# Altium project Chov3.PrjPCB
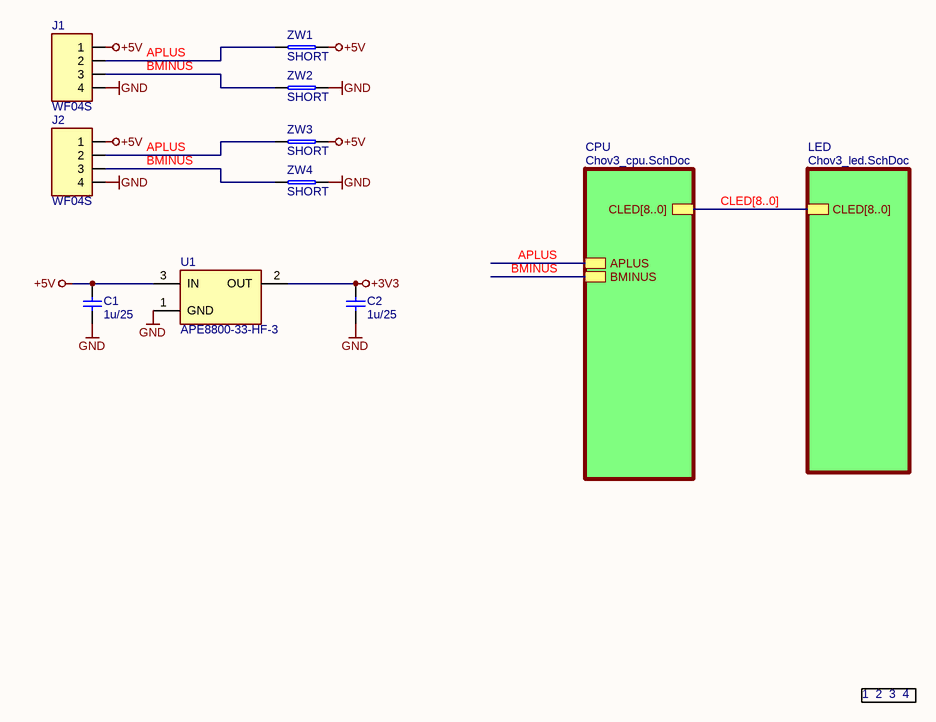
[diagram p0: Chov3_main.SchDoc]
Nazwa_Projektu: Lampka LED na choinkê; Wersja: 2
3 sheets, 55 parts. Net scope: hierarchical (ports join the sheet entries above them; power ports are global).
Board files: Chov3.PcbDoc, Chov3F.PcbDoc
Sheets:
  Chov3_main.SchDoc
    CPU = Chov3_cpu.SchDoc
    LED = Chov3_led.SchDoc

## Sheet Chov3_main.SchDoc
size A4; DocumentNumber: 1; SheetNumber: 1; SheetTotal: 3; LotOfPieces: 1

### Parts
C1  OtherParams: 1u/25  [0805]  (hidden comment: CL21B105KAFNNNG)
C2  OtherParams: 1u/25  [0805]  (hidden comment: CL21B105KAFNNNG)
J1  WF04S  [WF04S]
J2  WF04S  [WF04S]
NUMBERS1  WARSTWYT_M1_M2_B  [WARSTWYT_M1_M2_B]  (value not drawn)  (no BOM)
U1  APE8800-33-HF-3  [SOT23-3]
ZW1  SHORT  [SHORT0805]
ZW2  SHORT  [SHORT0805]
ZW3  SHORT  [SHORT0805]
ZW4  SHORT  [SHORT0805]

### Sub-sheets
CPU = Chov3_cpu.SchDoc: CLED[8..0], APLUS, BMINUS
LED = Chov3_led.SchDoc: CLED[8..0]

### Nets
+3V3: C2.1 U1.2(OUT)
+5V: C1.1 J1.1 J2.1 U1.3(IN) ZW1.2 ZW3.2
GND: C1.2 C2.2 J1.4 J2.4 U1.1(GND) ZW2.2 ZW4.2
APLUS: J1.2 J2.2 ZW1.1 ZW3.1 ; sheet CPU/APLUS
BMINUS: J1.3 J2.3 ZW2.1 ZW4.1 ; sheet CPU/BMINUS

### Buses and harness runs
bus CLED[8..0] = sheet CPU/CLED[8..0] = sheet LED/CLED[8..0]

### Notes on the sheet
- Wariant:
- Rev.
- /
- Projekt i wykonanie: (C) Miroslaw Lach MRQ, www.mlach.com
- git:
- Page:
- Plik:
- (in symbol WARSTWYT_M1_M2_B[[/\]]WARSTWYT_M1_M2_B) 1; 2; 3; 4

### Library data of the parts
C1 C2 = CL21B105KAFNNNG[[/\]]0805[[/\]]25V[[/\]]10%[[/\]]1u/25: MaxVoltage: 25V; Tolerance: 10%; Descript: Kondensator: ceramiczny; MLCC; 1uF; 25V; X7R; ±10%; SMD; 0805; Currency5: PLN; Value: CL21B105KAFNNNG; Dimensions: 0805; Supplier5: tme.pl; Reference5: CL21B105KAFNNNG; Manufacturer5: Samsung; Typ5: CL21B105KAFNNNG; Price5: 0,051; DateOfPrice5: 2016-08-23
J1 J2 = WF04S[[/\]]WF04S: Descript: connector 2.54mm pitch, THT, 4 pole, straight, male; Currency5: PLN; Value: WF04S; Dimensions: WF04S; Supplier5: maritex.com.pl; Reference5: WF04S; Price5: 0,069; DateOfPrice5: 2015-01-26
NUMBERS1 = WARSTWYT_M1_M2_B[[/\]]WARSTWYT_M1_M2_B: Value: WARSTWYT_M1_M2_B; Dimensions: WARSTWYT_M1_M2_B
U1 = APE8800-33-HF-3[[/\]]SOT23-3: Descript: Low quiescent current LDO, 3.3V, 300mA, SOT-23; Reference5: APE8800N-33-HF-3; Currency5: PLN; Value: APE8800-33-HF-3; Dimensions: SOT23-3; Supplier5: tme.pl; Manufacturer5: Advanced Power Electronics; Typ5: APE8800N-33-HF-3; Price5: 1,3603; DateOfPrice5: 2015-12-27
ZW1-ZW4 = SHORT[[/\]]SHORT[[/\]]0[[/\]]1%[[/\]]SHORT0805: DissPower: 0; Tolerance: 1%; Currency5: PLN; Value: SHORT; OtherParams: SHORT0805; Dimensions: SHORT; Price5: 0; DateOfPrice5: 2016-12-14

## Sheet Chov3_cpu.SchDoc
size A4; DocumentNumber: 2; SheetNumber: 2; SheetTotal: 3; LotOfPieces: 1
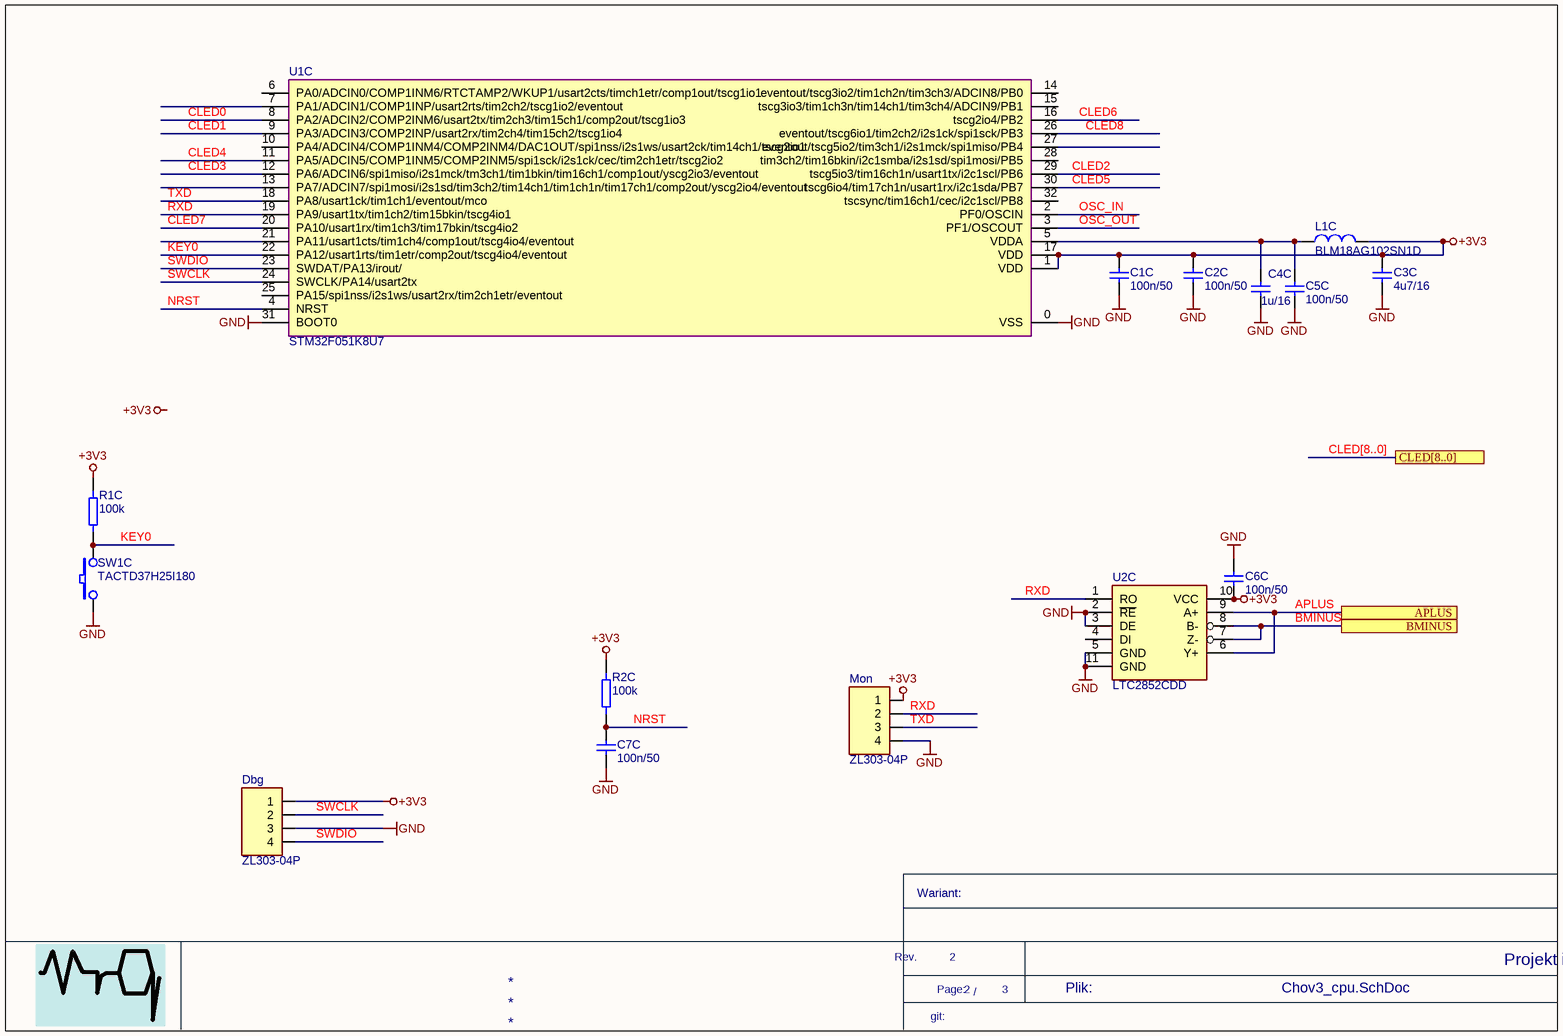
[diagram p1: Chov3_cpu.SchDoc]

### Parts
C1C  OtherParams: 100n/50  [0603-IPC]  (hidden comment: CL10B104JB8NNNC)
C2C  OtherParams: 100n/50  [0603-IPC]  (hidden comment: CL10B104JB8NNNC)
C3C  OtherParams: 4u7/16  [0805]  (hidden comment: 0805YC475KAT2A)
C4C  OtherParams: 1u/16  [0603-IPC]  (hidden comment: CL10B105KO8NNNC)
C5C  OtherParams: 100n/50  [0603-IPC]  (hidden comment: CL10B104JB8NNNC)
C6C  OtherParams: 100n/50  [0603-IPC]  (hidden comment: CL10B104JB8NNNC)
C7C  OtherParams: 100n/50  [0603-IPC]  (hidden comment: CL10B104JB8NNNC)
Dbg  ZL303-04P  [PLMS4S]
L1C  BLM18AG102SN1D  [0603-IPC]
Mon  ZL303-04P  [PLMS4S]
R1C  OtherParams: 100k  [0603-IPC]  (hidden comment: 0603SAF1003T5E)
R2C  OtherParams: 100k  [0603-IPC]  (hidden comment: 0603SAF1003T5E)
SW1C  TACTD37H25I180  [TACTD37H25I180]
U1C  STM32F051K8U7  [UFQFPN32_5x5]
U2C  LTC2852CDD  [MO-229WEED-2]

### Ports
APLUS, BMINUS, CLED[8..0]

### Nets
+3V3: C1C.1 C2C.1 C3C.1 C6C.1 Dbg.1 L1C.2 Mon.1 R1C.1 R2C.1 U1C.1(VDD) U1C.17(VDD) U2C.10(VCC)
GND: C1C.2 C2C.2 C3C.2 C4C.2 C5C.2 C6C.2 C7C.2 Dbg.3 Mon.4 SW1C.1 U1C.0(VSS) U1C.31(BOOT0) U2C.2(~{RE}) U2C.3(DE) U2C.5(GND) U2C.11(GND)
APLUS: U2C.6(Y+) U2C.9(A+) ; port APLUS
BMINUS: U2C.7(Z-) U2C.8(B-) ; port BMINUS
CLED0: U1C.8(PA2/ADCIN2/COMP2INM6/usart2tx/tim2ch3/tim15ch1/comp2out/tscg1io3)
CLED1: U1C.9(PA3/ADCIN3/COMP2INP/usart2rx/tim2ch4/tim15ch2/tscg1io4)
CLED2: U1C.29(tscg5io3/tim16ch1n/usart1tx/i2c1scl/PB6)
CLED3: U1C.12(PA6/ADCIN6/spi1miso/i2s1mck/tm3ch1/tim1bkin/tim16ch1/comp1out/yscg2io3/eventout)
CLED4: U1C.11(PA5/ADCIN5/COMP1INM5/COMP2INM5/spi1sck/i2s1ck/cec/tim2ch1etr/tscg2io2)
CLED5: U1C.30(tscg6io4/tim17ch1n/usart1rx/i2c1sda/PB7)
CLED6: U1C.16(tscg2io4/PB2)
CLED7: U1C.20(PA10/usart1rx/tim1ch3/tim17bkin/tscg4io2)
CLED8: U1C.26(eventout/tscg6io1/tim2ch2/i2s1ck/spi1sck/PB3)
KEY0: R1C.2 SW1C.2 U1C.22(PA12/usart1rts/tim1etr/comp2out/tscg4io4/eventout)
NRST: C7C.1 R2C.2 U1C.4(NRST)
OSC_IN: U1C.2(PF0/OSCIN)
OSC_OUT: U1C.3(PF1/OSCOUT)
RXD: Mon.2 U1C.19(PA9/usart1tx/tim1ch2/tim15bkin/tscg4io1) U2C.1(RO)
SWCLK: Dbg.2 U1C.24(SWCLK/PA14/usart2tx)
SWDIO: Dbg.4 U1C.23(SWDAT/PA13/irout/)
TXD: Mon.3 U1C.18(PA8/usart1ck/tim1ch1/eventout/mco)
NetC4C_1: C4C.1 C5C.1 L1C.1 U1C.5(VDDA)

Not connected (* = marked no-connect by the designer): U1C 6(PA0/ADCIN0/COMP1INM6/RTCTAMP2/WKUP1/usart2cts/timch1etr/comp1out/tscg1io1) 7(PA1/ADCIN1/COMP1INP/usart2rts/tim2ch2/tscg1io2/eventout) 10(PA4/ADCIN4/COMP1INM4/COMP2INM4/DAC1OUT/spi1nss/i2s1ws/usart2ck/tim14ch1/tscg2io1) 13(PA7/ADCIN7/spi1mosi/i2s1sd/tim3ch2/tim14ch1/tim1ch1n/tim17ch1/comp2out/yscg2io4/eventout) 14(eventout/tscg3io2/tim1ch2n/tim3ch3/ADCIN8/PB0) 15(tscg3io3/tim1ch3n/tim14ch1/tim3ch4/ADCIN9/PB1) 21(PA11/usart1cts/tim1ch4/comp1out/tscg4io4/eventout) 25(PA15/spi1nss/i2s1ws/usart2rx/tim2ch1etr/eventout) 27(eventout/tscg5io2/tim3ch1/i2s1mck/spi1miso/PB4) 28(tim3ch2/tim16bkin/i2c1smba/i2s1sd/spi1mosi/PB5) 32(tscsync/tim16ch1/cec/i2c1scl/PB8); U2C 4(DI)

### Buses and harness runs
bus CLED[8..0] = port CLED[8..0]

### Notes on the sheet
- Labels drawn without touching a wire or pin: +3V3
- Wariant:
- Rev.
- /
- Projekt i wykonanie: (C) Miroslaw Lach MRQ, www.mlach.com
- git:
- Page:
- Plik:

### Library data of the parts
C1C C2C C5C C6C C7C = CL10B104JB8NNNC[[/\]]0603[[/\]]50V[[/\]]10%[[/\]]100n/50: MaxVoltage: 50V; Tolerance: 10%; Descript: capacitor 100nF, 50V, X7R, 603, 10%; Currency5: PLN; Value: CL10B104JB8NNNC; Dimensions: 0603; Supplier5: tme.pl; Reference5: CL10B104JB8NNNC; Manufacturer5: Samsung; Typ5: CL10B104JB8NNNC; Price5: 0,02105; DateOfPrice5: 2016-08-17
C3C = 0805YC475KAT2A[[/\]]0805[[/\]]16V[[/\]]10%[[/\]]4u7/16: MaxVoltage: 16V; Tolerance: 10%; Descript: capacitor 4.7uF,16V, X7R, 0805; Currency5: PLN; Value: 0805YC475KAT2A; Dimensions: 0805; Supplier5: tme.pl; Reference5: 0805YC475KAT2A; Manufacturer5: AVX; Typ5: 0805YC475KAT2A; Price5: 0,25; DateOfPrice5: 2016-08-23
C4C = CL10B105KO8NNNC[[/\]]0603[[/\]]16V[[/\]]10%[[/\]]1u/16: MaxVoltage: 16V; Tolerance: 10%; Descript: capacitor 1uF, 16V, 0603, 10%, X7R; Currency5: PLN; Value: CL10B105KO8NNNC; Dimensions: 0603; Supplier5: tme.pl; Reference5: CL10B105KO8NNNC; Manufacturer5: Samsung; Typ5: CL10B105KO8NNNC; Price5: 0,02848; DateOfPrice5: 2016-02-11
Dbg Mon = ZL303-04P[[/\]]4x2mm: Descript: connector 2.00mm pitch, 4 poles, one row; Currency5: PLN; Value: ZL303-04P; Dimensions: 4x2mm; Supplier5: tme.pl; Reference5: ZL303-04P; Price5: 0,23067; DateOfPrice5: 2016-08-23; Manufacturer5: Ninigi; Typ5: ZL303-04P
L1C = BLM18AG102SN1D[[/\]]0603[[/\]]BLM18AG102SN1D: Descript: Chip inductor SMD, 0603, Imax=0.4A,Z=1000ohm,  Rdc=0.15ohm; Currency5: PLN; Value: BLM18AG102SN1D; OtherParams: BLM18AG102SN1D; Dimensions: 0603; Supplier5: tme.pl; Reference5: BLM18AG102SN1D; Manufacturer5: Murata; Typ5: BLM18AG102SN1D; Price5: 0,07377; DateOfPrice5: 2016-06-06
R1C = 0603SAF1003T5E[[/\]]0603[[/\]]0.1W[[/\]]1%[[/\]]100k: DissPower: 0.1W; Tolerance: 1%; Descript: Rezystor: thick film; SMD; 0603; 100k?; 0,1W; ±1%; -55÷125°C; Reference5: SMD0603-100K-1%; Currency5: PLN; Value: 0603SAF1003T5E; Dimensions: 0603; Supplier5: tme.pl; Manufacturer5: Royal Ohm; Typ5: 0603SAF1003T5E; Price5: 0,02511; DateOfPrice5: 2016-02-11
R2C = 0603SAF1003T5E[[/\]]0603[[/\]]0.1W[[/\]]1%[[/\]]100k: Descript: Rezystor: thick film; SMD; 0603; 100k?; 0,1W; ±1%; -55÷125°C; DissPower: 0.1W; Tolerance: 1%; Reference5: SMD0603-100K-1%; Currency5: PLN; Value: 0603SAF1003T5E; Dimensions: 0603; Supplier5: tme.pl; Manufacturer5: Royal Ohm; Typ5: 0603SAF1003T5E; Price5: 0,02511; DateOfPrice5: 2016-02-11
SW1C = TACTD37H25I180[[/\]]3.7x6.1x2.5: Descript: TACT switch 3.7x6.1x2.5, SMD, dustproof; Currency5: PLN; Value: TACTD37H25I180; Dimensions: 3.7x6.1x2.5; Supplier5: maritex.com.pl; Reference5: TACTD37H25I180; Manufacturer5: www.innocentswitch.co.kr; Price5: 0,54; DateOfPrice5: 2016-06-06; OtherParams: TACTD37H25I180
U1C = STM32F051K8U7[[/\]]UFQFPN32_5x5: Descript: MCU, 32BIT, CORTEX-M0, 48MHZ, UFQFPN-32; Reference5: 2333349; Currency5: PLN; Value: STM32F051K8U7; Dimensions: UFQFPN32_5x5; Supplier5: farnell.com; Manufacturer5: ST; Typ5: STM32F051K8U7; Price5: 9,97; DateOfPrice5: 2015-05-01
U2C = LTC2852CDD[[/\]]MO-229WEED-2: Descript: RS485, TXRX, FULL-DUPLEX, 10DFN; Reference5: 2294421; Typ5: LTC2852CDD#PBF; Currency5: PLN; Value: LTC2852CDD; Dimensions: MO-229WEED-2; Supplier5: farnell.com; Manufacturer5: Linear Technology; Price5: 9,43; DateOfPrice5: 2015-05-01

## Sheet Chov3_led.SchDoc
size A4; DocumentNumber: 3; SheetNumber: 3; SheetTotal: 3; LotOfPieces: 1
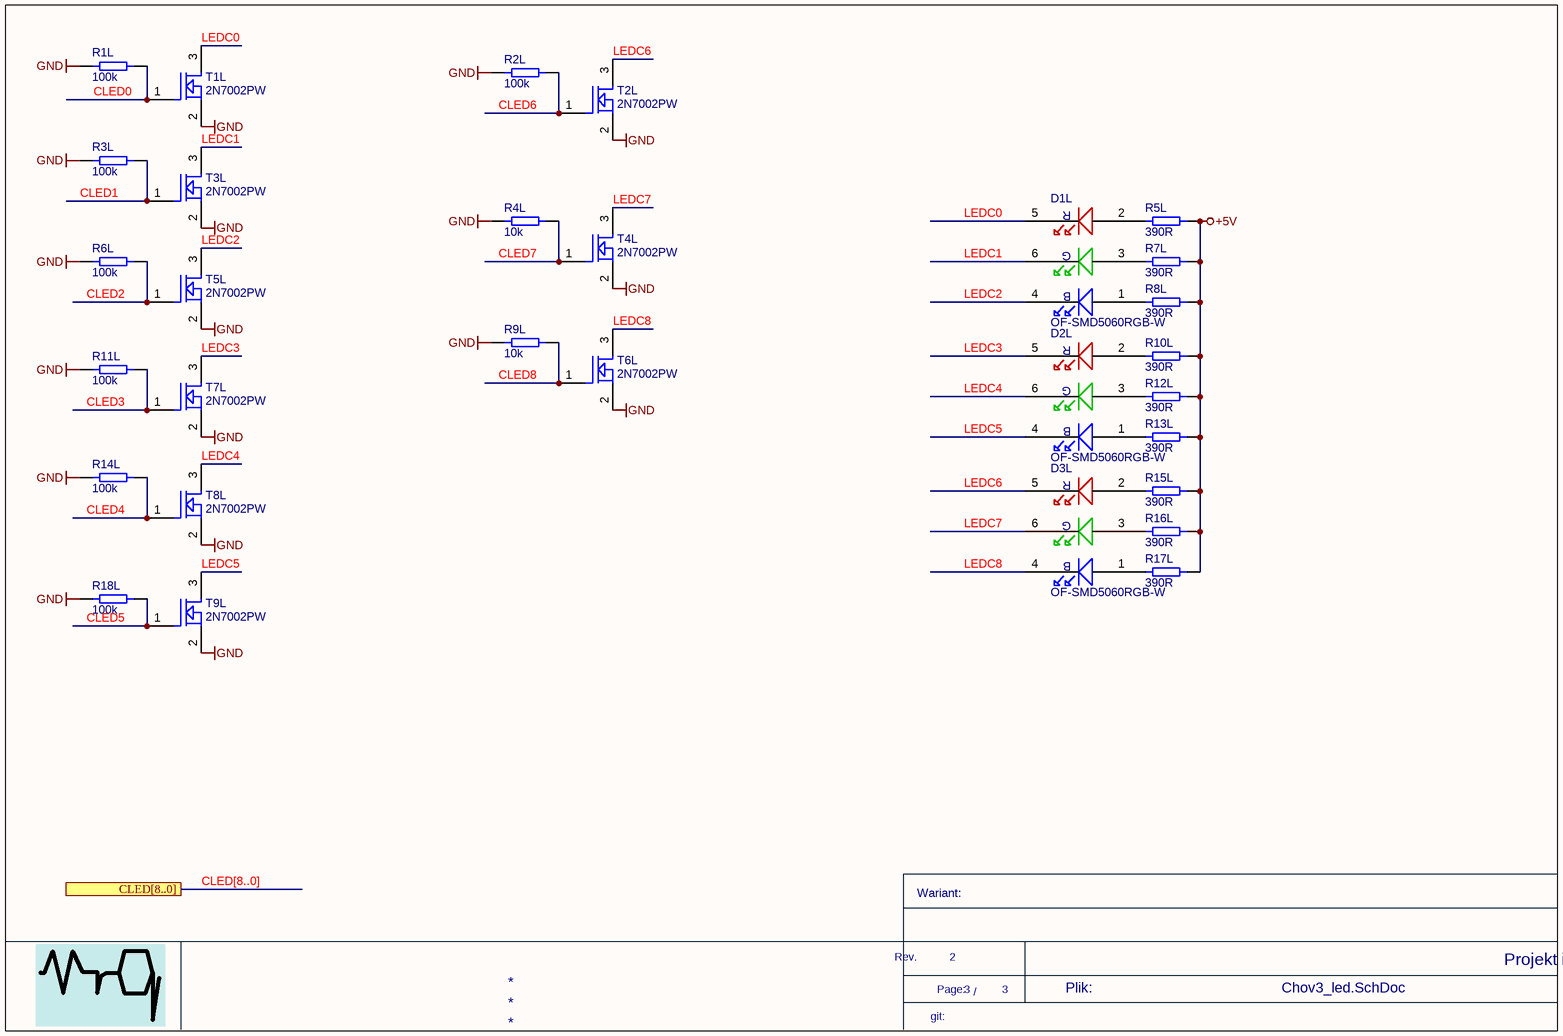
[diagram p2: Chov3_led.SchDoc]

### Parts
D1L  OF-SMD5060RGB-W  [OF-SMD5060RGB-W]
D2L  OF-SMD5060RGB-W  [OF-SMD5060RGB-W]
D3L  OF-SMD5060RGB-W  [OF-SMD5060RGB-W]
R1L  OtherParams: 100k  [0603-IPC]  (hidden comment: 0603SAF1003T5E)
R2L  OtherParams: 100k  [0603-IPC]  (hidden comment: 0603SAF1003T5E)
R3L  OtherParams: 100k  [0603-IPC]  (hidden comment: 0603SAF1003T5E)
R4L  OtherParams: 10k  [0603-IPC]  (hidden comment: 0603WGF10KT5E)
R5L  OtherParams: 390R  [0805]  (hidden comment: 0805WAF 390R T5E)
R6L  OtherParams: 100k  [0603-IPC]  (hidden comment: 0603SAF1003T5E)
R7L  OtherParams: 390R  [0805]  (hidden comment: 0805WAF 390R T5E)
R8L  OtherParams: 390R  [0805]  (hidden comment: 0805WAF 390R T5E)
R9L  OtherParams: 10k  [0603-IPC]  (hidden comment: 0603WGF10KT5E)
R10L  OtherParams: 390R  [0805]  (hidden comment: 0805WAF 390R T5E)
R11L  OtherParams: 100k  [0603-IPC]  (hidden comment: 0603SAF1003T5E)
R12L  OtherParams: 390R  [0805]  (hidden comment: 0805WAF 390R T5E)
R13L  OtherParams: 390R  [0805]  (hidden comment: 0805WAF 390R T5E)
R14L  OtherParams: 100k  [0603-IPC]  (hidden comment: 0603SAF1003T5E)
R15L  OtherParams: 390R  [0805]  (hidden comment: 0805WAF 390R T5E)
R16L  OtherParams: 390R  [0805]  (hidden comment: 0805WAF 390R T5E)
R17L  OtherParams: 390R  [0805]  (hidden comment: 0805WAF 390R T5E)
R18L  OtherParams: 100k  [0603-IPC]  (hidden comment: 0603SAF1003T5E)
T1L  2N7002PW  [SOT323-3_FLOW]
T2L  2N7002PW  [SOT323-3_FLOW]
T3L  2N7002PW  [SOT323-3_FLOW]
T4L  2N7002PW  [SOT323-3_FLOW]
T5L  2N7002PW  [SOT323-3_FLOW]
T6L  2N7002PW  [SOT323-3_FLOW]
T7L  2N7002PW  [SOT323-3_FLOW]
T8L  2N7002PW  [SOT323-3_FLOW]
T9L  2N7002PW  [SOT323-3_FLOW]

### Ports
CLED[8..0]

### Nets
+5V: R5L.2 R7L.2 R8L.2 R10L.2 R12L.2 R13L.2 R15L.2 R16L.2 R17L.2
GND: R1L.1 R2L.1 R3L.1 R4L.1 R6L.1 R9L.1 R11L.1 R14L.1 R18L.1 T1L.2(SOURCE) T2L.2(SOURCE) T3L.2(SOURCE) T4L.2(SOURCE) T5L.2(SOURCE) T6L.2(SOURCE) T7L.2(SOURCE) T8L.2(SOURCE) T9L.2(SOURCE)
CLED0: R1L.2 T1L.1(GATE)
CLED1: R3L.2 T3L.1(GATE)
CLED2: R6L.2 T5L.1(GATE)
CLED3: R11L.2 T7L.1(GATE)
CLED4: R14L.2 T8L.1(GATE)
CLED5: R18L.2 T9L.1(GATE)
CLED6: R2L.2 T2L.1(GATE)
CLED7: R4L.2 T4L.1(GATE)
CLED8: R9L.2 T6L.1(GATE)
LEDC0: D1L.5(CATH) T1L.3(DRAIN)
LEDC1: D1L.6(CATH) T3L.3(DRAIN)
LEDC2: D1L.4(CATH) T5L.3(DRAIN)
LEDC3: D2L.5(CATH) T7L.3(DRAIN)
LEDC4: D2L.6(CATH) T8L.3(DRAIN)
LEDC5: D2L.4(CATH) T9L.3(DRAIN)
LEDC6: D3L.5(CATH) T2L.3(DRAIN)
LEDC7: D3L.6(CATH) T4L.3(DRAIN)
LEDC8: D3L.4(CATH) T6L.3(DRAIN)
NetD1L_1: D1L.1(ANOD) R8L.1
NetD1L_2: D1L.2(ANOD) R5L.1
NetD1L_3: D1L.3(ANOD) R7L.1
NetD2L_1: D2L.1(ANOD) R13L.1
NetD2L_2: D2L.2(ANOD) R10L.1
NetD2L_3: D2L.3(ANOD) R12L.1
NetD3L_1: D3L.1(ANOD) R17L.1
NetD3L_2: D3L.2(ANOD) R15L.1
NetD3L_3: D3L.3(ANOD) R16L.1

### Buses and harness runs
bus CLED[8..0] = port CLED[8..0]

### Notes on the sheet
- Wariant:
- Rev.
- /
- Projekt i wykonanie: (C) Miroslaw Lach MRQ, www.mlach.com
- git:
- Page:
- Plik:
- (in symbol OF-SMD5060RGB-W[[/\]]5060) R; G; B

### Library data of the parts
D1L D2L D3L = OF-SMD5060RGB-W[[/\]]5060: Descript: 5050 Single Chip RGB Color Top LED; Currency5: PLN; Value: OF-SMD5060RGB-W; Dimensions: 5060; Supplier5: tme.pl; Reference5: OF-SMD5060RGB-W; Manufacturer5: Optoflash; Typ5: OF-SMD5060RGB-W; Price5: 1,3206; DateOfPrice5: 2014-01-04
R1L R2L R3L R6L R11L R14L R18L = 0603SAF1003T5E[[/\]]0603[[/\]]0.1W[[/\]]1%[[/\]]100k: as R1C on sheet Chov3_cpu; Value: 0603SAF1003T5E; Dimensions: 0603; Supplier5: tme.pl; Manufacturer5: Royal Ohm; Typ5: 0603SAF1003T5E; Price5: 0,02511; DateOfPrice5: 2016-02-11
R4L R9L = 0603WGF10KT5E[[/\]]0603[[/\]]0.1W[[/\]]1%[[/\]]10k: DissPower: 0.1W; Tolerance: 1%; Descript: Resistor 10kohm, 0603, 1%; Reference5: SMD0603-10K-1%; Currency5: PLN; Value: 0603WGF10KT5E; Dimensions: 0603; Supplier5: tme.pl; Manufacturer5: Royal Ohm; Typ5: 0603WGF 10K T5E; Price5: 0,02755; DateOfPrice5: 2016-06-02
R5L R7L R8L R10L R12L R13L R15L R16L R17L = 0805WAF 390R T5E[[/\]]0805[[/\]]0.125W[[/\]]1%[[/\]]390R: DissPower: 0.125W; Tolerance: 1%; Descript: Resistor 390ohm, 0805, 1%; Reference5: SMD0805-390R-1%; Currency5: PLN; Value: 0805WAF 390R T5E; Dimensions: 0805; Supplier5: tme.pl; Manufacturer5: Royal Ohm; Typ5: 0805WAF 390R T5E; Price5: 0,029; DateOfPrice5: 2013-06-18
T1L T2L T3L T4L T5L T6L T7L T8L T9L = 2N7002PW[[/\]]SOT323-3: Descript: N-channel enhacement-mode vertical DMOS FET; Reference5: 1829184; Currency5: PLN; Value: 2N7002PW; Dimensions: SOT323-3; Supplier5: farnell.com; Price5: 0,88; DateOfPrice5: 2016-04-09; Manufacturer5: NXP; Typ5: 2N7002PW

## Nets that join several sheets
+3V3: Chov3_main (C2.1 U1.2), Chov3_cpu (12 pins)
+5V: Chov3_main (6 pins), Chov3_led (9 pins)
GND: Chov3_main (7 pins), Chov3_cpu (16 pins), Chov3_led (18 pins)
APLUS: Chov3_main (J1.2 J2.2 ZW1.1 ZW3.1), Chov3_cpu (U2C.6 U2C.9)
BMINUS: Chov3_main (J1.3 J2.3 ZW2.1 ZW4.1), Chov3_cpu (U2C.7 U2C.8)
CLED0: Chov3_cpu (U1C.8), Chov3_led (R1L.2 T1L.1)
CLED1: Chov3_cpu (U1C.9), Chov3_led (R3L.2 T3L.1)
CLED2: Chov3_cpu (U1C.29), Chov3_led (R6L.2 T5L.1)
CLED3: Chov3_cpu (U1C.12), Chov3_led (R11L.2 T7L.1)
CLED4: Chov3_cpu (U1C.11), Chov3_led (R14L.2 T8L.1)
CLED5: Chov3_cpu (U1C.30), Chov3_led (R18L.2 T9L.1)
CLED6: Chov3_cpu (U1C.16), Chov3_led (R2L.2 T2L.1)
CLED7: Chov3_cpu (U1C.20), Chov3_led (R4L.2 T4L.1)
CLED8: Chov3_cpu (U1C.26), Chov3_led (R9L.2 T6L.1)